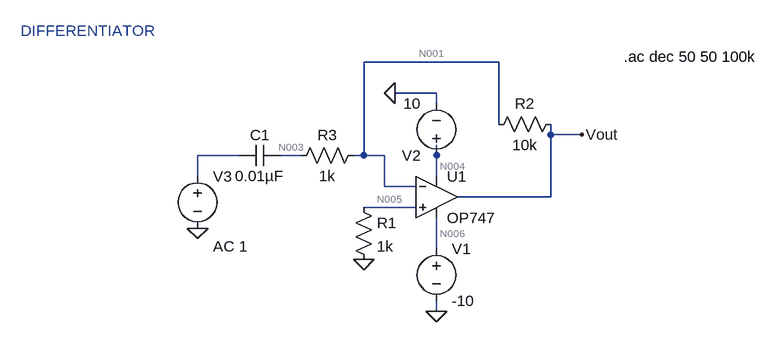
[diagram p0: schematic diff_op.asc]
diff_op.asc, the LTspice schematic file:
Version 4.1
SHEET 1 880 680
WIRE 464 -16 256 -16
WIRE 368 32 304 32
WIRE 368 48 368 32
WIRE 464 80 464 -16
WIRE 544 96 544 80
WIRE 592 96 544 96
WIRE 64 128 0 128
WIRE 160 128 128 128
WIRE 256 128 256 -16
WIRE 256 128 240 128
WIRE 288 128 256 128
WIRE 368 128 368 112
WIRE 0 160 0 128
WIRE 368 160 368 128
WIRE 288 176 288 128
WIRE 336 176 288 176
WIRE 544 192 544 96
WIRE 544 192 400 192
WIRE 336 208 256 208
WIRE 368 272 368 224
WIRE 368 368 368 352
FLAG 368 368 0
FLAG 256 288 0
FLAG 0 240 0
FLAG 304 32 0
FLAG 592 96 Vout
SYMBOL OpAmps\\OP747 368 128 R0
SYMATTR InstName U1
SYMBOL res 240 192 R0
SYMATTR InstName R1
SYMATTR Value 1k
SYMBOL res 560 64 R90
WINDOW 0 0 56 VBottom 2
WINDOW 3 32 56 VTop 2
SYMATTR InstName R2
SYMATTR Value 10k
SYMBOL res 256 112 R90
WINDOW 0 0 56 VBottom 2
WINDOW 3 32 56 VTop 2
SYMATTR InstName R3
SYMATTR Value 1k
SYMBOL voltage 368 256 R0
WINDOW 123 0 0 Left 0
WINDOW 39 0 0 Left 0
SYMATTR InstName V1
SYMATTR Value -10
SYMBOL voltage 368 144 R180
WINDOW 123 0 0 Left 0
WINDOW 39 0 0 Left 0
SYMATTR InstName V2
SYMATTR Value 10
SYMBOL voltage 0 144 R0
WINDOW 123 24 124 Left 2
WINDOW 39 0 0 Left 0
SYMATTR Value2 AC 1
SYMATTR InstName V3
SYMATTR Value ""
SYMBOL cap 128 112 R90
WINDOW 0 0 32 VBottom 2
WINDOW 3 32 32 VTop 2
SYMATTR InstName C1
SYMATTR Value 0.01µF
TEXT -272 -64 Left 2 ;DIFFERENTIATOR
TEXT 656 -24 Left 2 !.ac dec 50 50 100k

The netlist it stands for:
* diff_op.asc
X§U1 N005 N001 N004 N006 Vout OP747  ; pins In+ In- V+ V- OUT
R1 N005 0 1k
R2 Vout N001 10k
R3 N001 N003 1k
V1 N006 0 -10
V2 N004 0 10
V3 N002 0 AC 1
C1 N003 N002 0.01µF
* DIFFERENTIATOR
.ac dec 50 50 100k
.backanno
.end

* Results of the author's LTspice run, read from the files saved beside the schematic
* Operating Point, zero values left out:
*   V(n001) = 91.21 µV
*   V(n006) = -10 V
*   V(vout) = -928.2 nV
*   V(n005) = 11.21 µV
*   V(n004) = 10 V
*   V(n003) = 91.21 µV
*   I(R1) = 11.21 nA
*   I(R2) = -9.214 nA
*   I(V1) = 268.6 µA
*   I(V2) = -268.6 µA
*   Ix(u1:1) = -11.21 nA
*   Ix(u1:2) = -9.214 nA
*   Ix(u1:99) = 268.6 µA
*   Ix(u1:50) = -268.6 µA
*   Ix(u1:45) = 9.214 nA
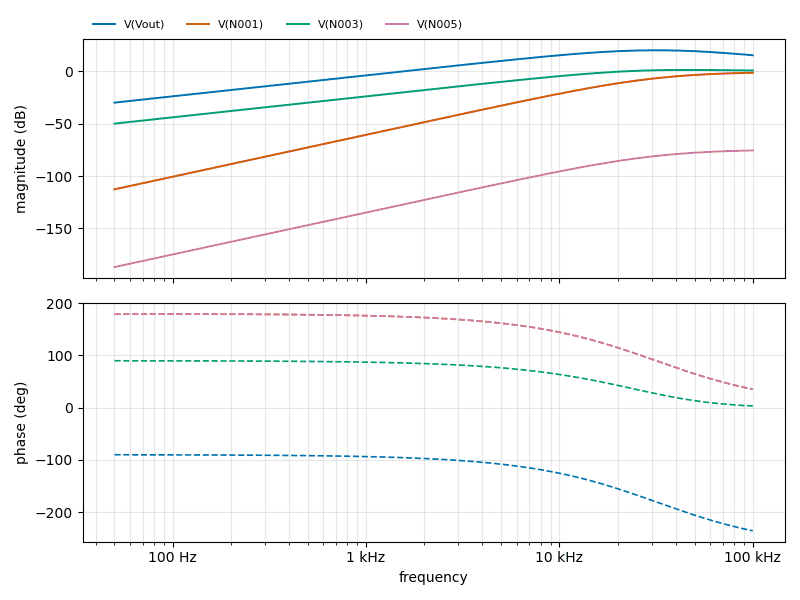
[diagram p1: AC Analysis of diff_op.asc, plotted from the saved traces]
* AC Analysis, 1 run:
*   V(Vout): -30.06 dB at 50 Hz, 15.08 dB at 100 kHz, peak 19.83 dB at 31.55 kHz, 3 dB below the peak at 12.97 kHz and 76.81 kHz
*   V(N001): -112.71 dB at 50 Hz, -1.56 dB at 100 kHz, peak -1.56 dB at 100 kHz, 3 dB below the peak at 42.77 kHz
*   V(N003): -50.06 dB at 50 Hz, 0.58 dB at 100 kHz, peak 1.12 dB at 45.6 kHz, 3 dB below the peak at 15.54 kHz
*   V(N005): -186.80 dB at 50 Hz, -75.64 dB at 100 kHz, peak -75.64 dB at 100 kHz, 3 dB below the peak at 42.77 kHz